# EAGLE design Mirtle_2020_drv8833 (EAGLE 7.6.0)
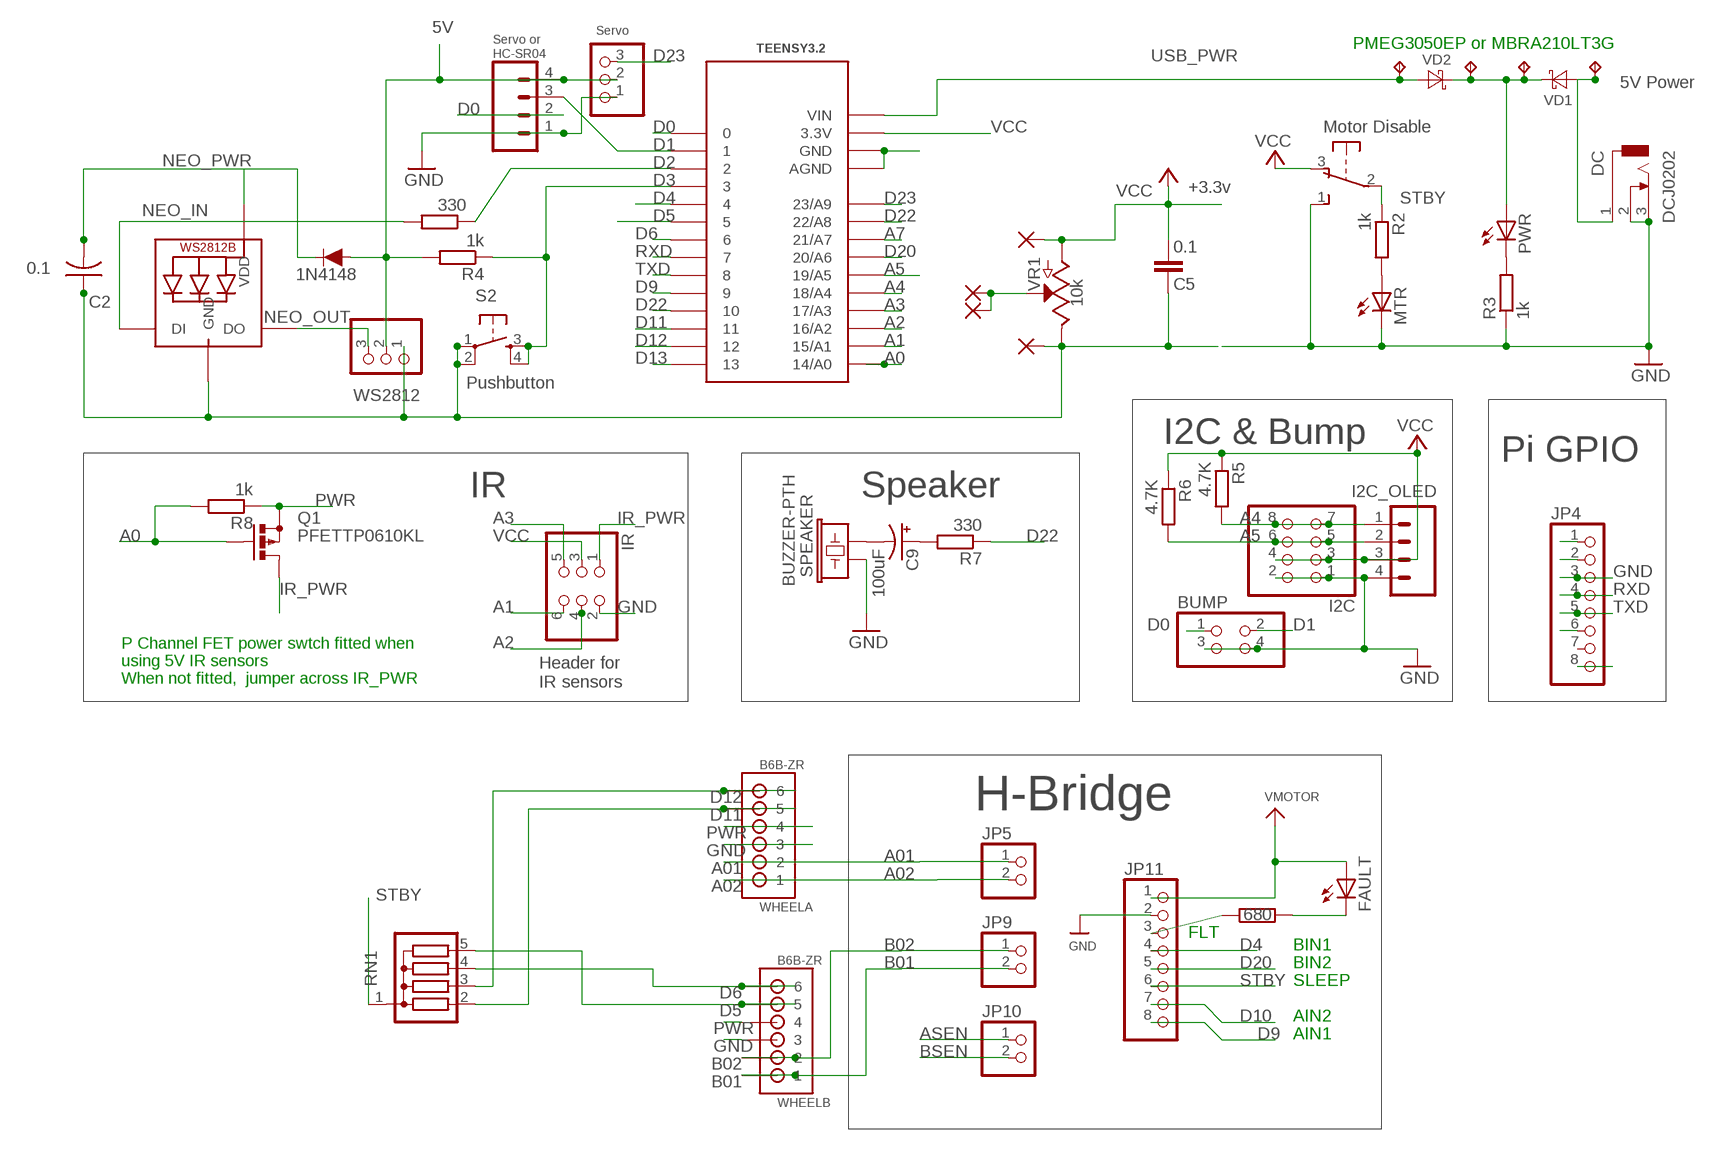
[diagram p0: schematic, sheet 1]

## Parts
BUMP  PINHD-2X2  [2X02]
C2  0.1  C-US025-024X044  [C025-024X044]
C5  0.1  CAPEZ  [CAP-PTH-SMALLEZ]
C9  100uF  CPOL-USE2.5-5  [E2,5-5]
DC  DCJ0202  [DCJ0202]
EXT  PINHD-1X3  [1X03]
FAULT  LED3MM  [LED3MM]
HC-SR04  CONN_04  [1X04]
I2C  PINHD-2X4  [2X04]
I2C_OLED  CONN_04  [1X04]
IN4148  200mA/100V/1V  DIODE-1N4148  [DIODE-1N4148]
IR  PINHD-2X3  [2X03]
JP4  PINHD-1X8BIG  [1X08-BIG]
JP5  HEADER-1X2ROUND  [1X02_ROUND]
JP9  HEADER-1X2ROUND  [1X02_ROUND]
JP10  HEADER-1X2ROUND  [1X02_ROUND]
JP11  HEADER-1X870MIL  [1X08_ROUND_70]
LED1  WS2812B5050  [WS2812B]
MTR  LED3MM  [LED3MM]
PAD6  1,6/0,8  [1,6/0,8]
PAD7  1,6/0,8  [1,6/0,8]
PAD8  1,6/0,8  [1,6/0,8]
PAD9  1,6/0,8  [1,6/0,8]
PWR  LED3MM  [LED3MM]
Q1  PFETTP0610KL  [TO92-OVAL]
R1  680  R-EU_0204/7  [0204/7]
R2  1k  R-EU_0204/5  [0204/5]
R3  1k  R-EU_0204/5  [0204/5]
R4  1k  R-EU_0204/5  [0204/5]
R5  4.7K  R-EU_0204/7  [0204/7]
R6  4.7K  R-EU_0204/7  [0204/7]
R7  330  R-EU_0204/7  [0204/7]
R8  1k  R-EU_0204/5  [0204/5]
R12  330  R-EU_0204/7  [0204/7]
RN1  G04R  [SIL5]
S2  TAC_SWITCHPTH  [TACTILE-PTH]
SPEAKER  BUZZER-PTH  [BUZZER-12MM]
SW1  OS102011MA1Q  [OS102011MA1Q]
TEENSY3.2  TEENSY_3.0_BASIC  [TEENSY_3.0_BASIC]
TP1  TPPAD1-13  [P1-13]
TP2  TPPAD1-13  [P1-13]
TP3  TPPAD1-13  [P1-13]
TP4  TPPAD1-13  [P1-13]
VD1  DIODE-SCHOTTKY-SMA  [SMA]
VD2  DIODE-SCHOTTKY-SMA  [SMA]
VR1  10k  POTENTIOMETER-PTH-9MM-1/20W-20%-KIT  [POT-PTH-ALPS-KIT]
WHEELA  B6B-ZR  [B6B-ZR]
WHEELB  B6B-ZR  [B6B-ZR]
WS2812  PINHD-1X3  [1X03]

## Nets
5VIN: DC.1 TP1.TP VD1.A
A0: Q1.2(G) R8.2 TEENSY3.2.14/A0
A1: IR.6 TEENSY3.2.15/A1
A01: JP5.1 WHEELA.2
A2: IR.4 TEENSY3.2.16/A2
A02: JP5.2 WHEELA.1
A3: IR.5 TEENSY3.2.17/A3
A4: I2C.7 I2C.8 I2C_OLED.1 R5.2 TEENSY3.2.18/A4
A5: I2C.5 I2C.6 I2C_OLED.2 R6.2 TEENSY3.2.19/A5
A7: PAD6.1(P) PAD9.1(P) TEENSY3.2.21/A7 VR1.P$2(S)
ASEN: JP10.1
B01: JP9.2 WHEELB.1
B02: JP9.1 WHEELB.2
BSEN: JP10.2
D0: BUMP.1 HC-SR04.2 TEENSY3.2.0
D1: BUMP.2 HC-SR04.3 TEENSY3.2.1
D2: R12.1 TEENSY3.2.2
D3: R4.1 S2.3 S2.4 TEENSY3.2.3
D4: JP11.4 TEENSY3.2.4
D5: RN1.5 TEENSY3.2.5 WHEELB.5
D6: RN1.4 TEENSY3.2.6 WHEELB.6
D9: JP11.8 TEENSY3.2.9
D10: JP11.7 TEENSY3.2.10
D11: RN1.2 TEENSY3.2.11 WHEELA.5
D12: RN1.3 TEENSY3.2.12 WHEELA.6
D13: TEENSY3.2.13
D20: JP11.5 TEENSY3.2.20/A6
D22: R7.1 TEENSY3.2.22/A8
D23: EXT.3 TEENSY3.2.23/A9
GND: BUMP.3 BUMP.4 C2.1 C5.1 DC.2 DC.3 EXT.1 HC-SR04.1 I2C.1 I2C.2 I2C_OLED.4 IR.2 JP4.3 JP4.8 JP11.2 LED1.3-GND(GND) MTR.K(C) PAD8.1(P) R3.1 S2.1 S2.2 SPEAKER.+ SW1.1(S) TEENSY3.2.AGND TEENSY3.2.GND VR1.P$1(E) WHEELA.3 WHEELB.3 WS2812.1
IR_PWR: IR.1 Q1.3(D)
N$1: JP11.3 R1.1
N$2: FAULT.K(C) R1.2
N$3: PWR.K(C) R3.2
N$8: MTR.A R2.2
N$10: JP4.6
N$15: C9.- SPEAKER.-
N$16: C9.+ R7.2
NEO_IN: LED1.4-DIN(DI) R12.2
NEO_OUT: LED1.2-DOUT(DO) WS2812.3
NEO_PWR: C2.2 IN4148.C LED1.1-VDD(VDD)
PWR: EXT.2 FAULT.A HC-SR04.4 IN4148.A JP4.1 JP4.2 JP11.1 PWR.A Q1.1(S) R4.2 R8.1 TP2.TP TP3.TP VD1.C VD2.C WHEELA.4 WHEELB.4 WS2812.2 ; supply symbol labelled VMOTOR
RXD: JP4.4 TEENSY3.2.7
STBY: JP11.6 R2.1 RN1.1 SW1.2(P)
TXD: JP4.5 TEENSY3.2.8
USB_PWR: TEENSY3.2.VIN TP4.TP VD2.A
VCC: C5.2 I2C.3 I2C.4 I2C_OLED.3 IR.3 PAD7.1(P) R5.1 R6.1 SW1.3(O) TEENSY3.2.3.3V VR1.P$3(A)
Unconnected: JP4.7 SW1.MT1(MT) SW1.MT2(MT)

## Notes on the sheet
- 5V | Servo | PMEG3050EP or MBRA210LT3G
- Servo or
- 5V Power
- Motor Disable
- +3.3v
- 1N4148
- Pushbutton
- I2C & Bump
- Pi GPIO
- IR | Speaker
- P Channel FET power swtch fitted when 
  using 5V IR sensors
  When not fitted,  jumper across IR_PWR
- Header for
  IR sensors
- H-Bridge
- FLT
- BIN1
- BIN2
- SLEEP
- AIN2
- AIN1

## Library data of the parts
BUMP = pinhead:PINHD-2X2: PIN HEADER
C2 = adafruit_mem:C-US: CAPACITOR, American symbol
C5 = SparkFun-Passives:CAP: Capacitor Standard 0603 ceramic capacitor, and 0.1" leaded capacitor.
C9 = adafruit:CPOL-US: POLARIZED CAPACITOR, American symbol
DC = con-jack:DCJ0202: DC POWER JACK Source: DCJ0202.pdf; OC_FARNELL: unknown; OC_NEWARK: unknown
EXT WS2812 = adafruit:PINHD-1X3: PIN HEADER
FAULT MTR PWR = led:LED: LED OSRAM: - CHIPLED LG R971, LG N971, LY N971, LG Q971, LY Q971, LO R971, LY R971 LH N974, LH R974 LS Q976, LO Q976, LY Q976 LO Q996 - Hyper CHIPLED LW Q18S LB Q993, LB Q99A, LB R99A - SideLED LS A670, LO A670, LY A670, LG A670, LP A670 LB A673, LV A673, LT A673, LW A673 LH A674 LY A675 LS A676, LA A676, LO A676, LY A676, LW A676 LS A679, LY A679, LG A679 - Hyper Micro SIDELED® LS Y876, LA Y876, LO Y876, LY Y876 LT Y87S - SmartLED LW L88C, LW L88S LB L89C, LB L89S, LG L890 LS L89K, LO L89K, LY L89K LS L896, LA L896, LO L896, LY L896 - TOPLED LS T670, LO T670, LY T670, LG T670, LP T670 LSG T670, LSP T670, LSY T670, LOP T670, LYG T670 LG T671, LOG T671, LSG T671 LB T673, LV T673, LT T673, LW T673 LH T674 LS T676, LA T676, LO T676, LY T676, LB T676, LH T676, LSB T676, LW T676 LB T67C, LV T67C, LT T67C, LS T67K, LO T67K, LY T67K, LW E67C LS E67B, LA E67B, LO E67B, LY E67B, LB E67C, LV E67C, LT E67C LW T67C LS T679, LY T679, LG T679 LS T770, LO T770, LY T770, LG T770, LP T770 LB T773, LV T773, LT T773, LW T773 LH T774 LS E675, LA E675, LY E675, LS T675 LS T776, LA T776, LO T776, LY T776, LB T776 LHGB T686 LT T68C, LB T68C - Hyper Mini TOPLED® LB M676 - Mini TOPLED Santana® LG M470 LS M47K, LO M47K, LY M47K Source: http://www.osram.convergy.de LUXEON: - LUMILED® LXK2-PW12-R00, LXK2-PW12-S00, LXK2-PW14-U00, LXK2-PW14-V00 LXK2-PM12-R00, LXK2-PM12-S00, LXK2-PM14-U00 LXK2-PE12-Q00, LXK2-PE12-R00, LXK2-PE12-S00, LXK2-PE14-T00, LXK2-PE14-U00 LXK2-PB12-K00, LXK2-PB12-L00, LXK2-PB12-M00, LXK2-PB14-N00, LXK2-PB14-P00, LXK2-PB14-Q00 LXK2-PR12-L00, LXK2-PR12-M00, LXK2-PR14-Q00, LXK2-PR14-R00 LXK2-PD12-Q00, LXK2-PD12-R00, LXK2-PD12-S00 LXK2-PH12-R00, LXK2-PH12-S00 LXK2-PL12-P00, LXK2-PL12-Q00, LXK2-PL12-R00 Source: www.luxeon.com KINGBRIGHT: KA-3528ASYC Source: www.kingbright.com
HC-SR04 I2C_OLED = SparkFun-Connectors:CONN_04: Multi connection point. Often used as Generic Header-pin footprint for 0.1 inch spaced/style header connections On any of the 0.1 inch spaced packages, you can populate with these: Break Away Headers - Straight <https://www.sparkfun.com/products/116> (PRT-00116) Break Away Male Headers - Right Angle <https://www.sparkfun.com/products/553> (PRT-00553) Female Headers <https://www.sparkfun.com/products/115> (PRT-00115) Break Away Headers - Machine Pin <https://www.sparkfun.com/products/117> (PRT-00117) Break Away Female Headers - Swiss Machine Pin <https://www.sparkfun.com/products/743> (PRT-00743) For SCREWTERMINALS and SPRING TERMINALS visit here: Screw Terimnals on SparkFun.com <https://www.sparkfun.com/search/results?term=Screw+Terminals> (5mm/3.5mm/2.54mm spacing) This device is also useful as a general connection point to wire up your design to another part of your project. Our various solder wires solder well into these plated through hole pads. Hook-Up Wire - Assortment (Stranded, 22 AWG) <https://www.sparkfun.com/products/11375> (PRT-11375) Hook-Up Wire - Assortment (Solid Core, 22 AWG) <https://www.sparkfun.com/products/11367> (PRT-11367) View the entire wire category on our website here <https://www.sparkfun.com/categories/141> Special notes: Molex polarized connector foot print use with SKU : PRT-08231 with associated crimp pins and housings. 1MM SMD Version SKU: PRT-10208; PROD_ID: CONN-09696
I2C = adafruit:PINHD-2X4: PIN HEADER
IN4148 = SparkFun-DiscreteSemi:DIODE: Diode These are standard reverse protection diodes and small signal diodes. SparkFun Products: SparkFun SparkPunk Sound Kit <https://www.sparkfun.com/products/11177> SparkFun ESP8266 Thing <https://www.sparkfun.com/products/13231>; PROD_ID: DIO-08378
IR = pinhead:PINHD-2X3: PIN HEADER
JP4 = adafruit:PINHD-1X8: PIN HEADER
JP5 JP9 JP10 = microbuilder:HEADER-1X2: PIN HEADER
JP11 = microbuilder:HEADER-1X8: PIN HEADER
LED1 = adafruitx:WS2812B
PAD6-PAD9 = wirepad:1,6/0,8: THROUGH-HOLE PAD
Q1 = adafruit:PFET: P-CHANNEL MOS FET
R1-R8 R12 = resistor:R-EU_: RESISTOR, European symbol
RN1 = resistor-sil:G04R: SIL RESISTOR; OC_FARNELL: unknown; OC_NEWARK: unknown
S2 = SparkFun-Electromechanical:TAC_SWITCH: Momentary Switch Button commonly used for reset or general input. Spark Fun Electronics SKU : COM-00097 SMT- SWCH-08247
SPEAKER = SparkFun-Electromechanical:BUZZER: Buzzer Small round buzzers that operate around the audible 2kHz range. You can use these as speakers to create simple music or user interfaces. Variant Overview: PTH - Mini Speaker - PC Mount 12mm 2.048kHz <https://www.sparkfun.com/products/7950> PTH_KIT - Mini Speaker - PC Mount 12mm 2.048kHz <https://www.sparkfun.com/products/7950> KIT simplifies soldering by adding stop mask to one side of the pads. PTH_NO_SILK - Mini Speaker - PC Mount 12mm 2.048kHz <https://www.sparkfun.com/products/7950> No silkscreen indicator of buzzer outline. PTH_KIT_NO_SILK - Mini Speaker - PC Mount 12mm 2.048kHz <https://www.sparkfun.com/products/7950> KIT package w/o silkscreen SMD - Buzzer Audio Magnetic (CCV-084B16) SMD buzzer used on, e.g. the LilyPad Buzzer <https://www.sparkfun.com/products/8463> and RFID USB Reader <https://www.sparkfun.com/products/9963>. SMD_KIT - Buzzer Audio Magnetic (CCV-084B16) SMD Buzzer with elongated pins to make soldering easier. Used on the SparkFun Simon Says - Surface Mount Soldering Kit <https://www.sparkfun.com/products/10935>.; PROD_ID: COMP-08253; SF_SKU: COM-07950
SW1 = adafruit_mem:OS102011MA1Q: OS10201MA1Q through-hole right angle switch http://www.ladyada.net/library/eagle
TEENSY3.2 = Teensy3.0_mem:TEENSY_3.0_BASIC: Basic Teensy 3.0 with none of the 'inner' pins enabled. See '+4', 'AllAnalogPins", and 'AllPins' packages for additional pin holes, as needed.
TP1-TP4 = testpad:TP: Test pad
VD1 VD2 = diod_barthess:DIODE-SCHOTTKY-: SCHOTTKY DIODE
VR1 = SparkFun-Resistors:POTENTIOMETER: Potentiometer (Pot) Three-terminal potentiometers, with an adjustable wiper and two adjustable resistors. A pot can be used to create a configurable voltage divider, or as a variable resistor. Variants ALPS_POT and ALPS_POT_KIT - PTH, breadboard compatible, 9mm square pots Rotary Potentiometer - Linear (10k ohm) <https://www.sparkfun.com/products/9288> (COM-09288) The KIT variant exposes copper on only one side of the PTH pad, so the part can only be assembled on one side of the PCB. Useful for beginner soldering kits.; PROD_ID: RES-09177; SF_SKU: COM-09288
WHEELA WHEELB = jst:B6B-ZR: JST-ZH Connector 6 pol, 1.5mm pitch Package: B6B-ZR Source: http://www.jst-mfg.com/product/pdf/eng/eZH.pdf

## Net classes
1 power: width 0.305 mm, clearance 0.305 mm

## Board
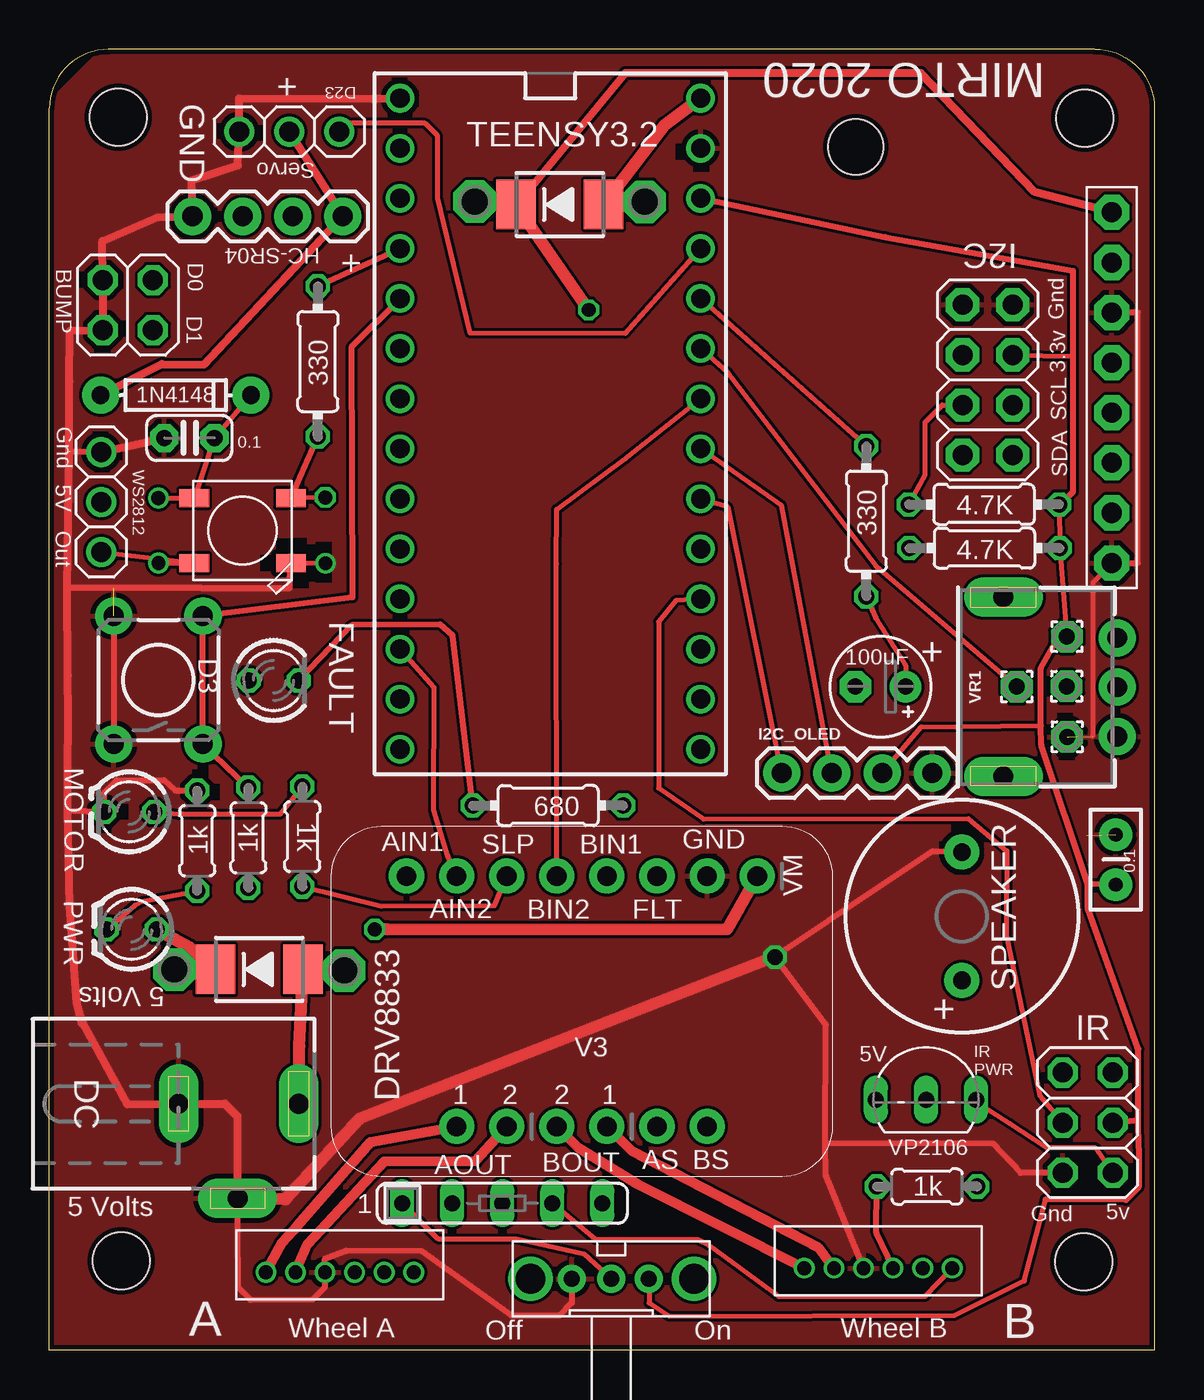
[diagram p1: board, top side]
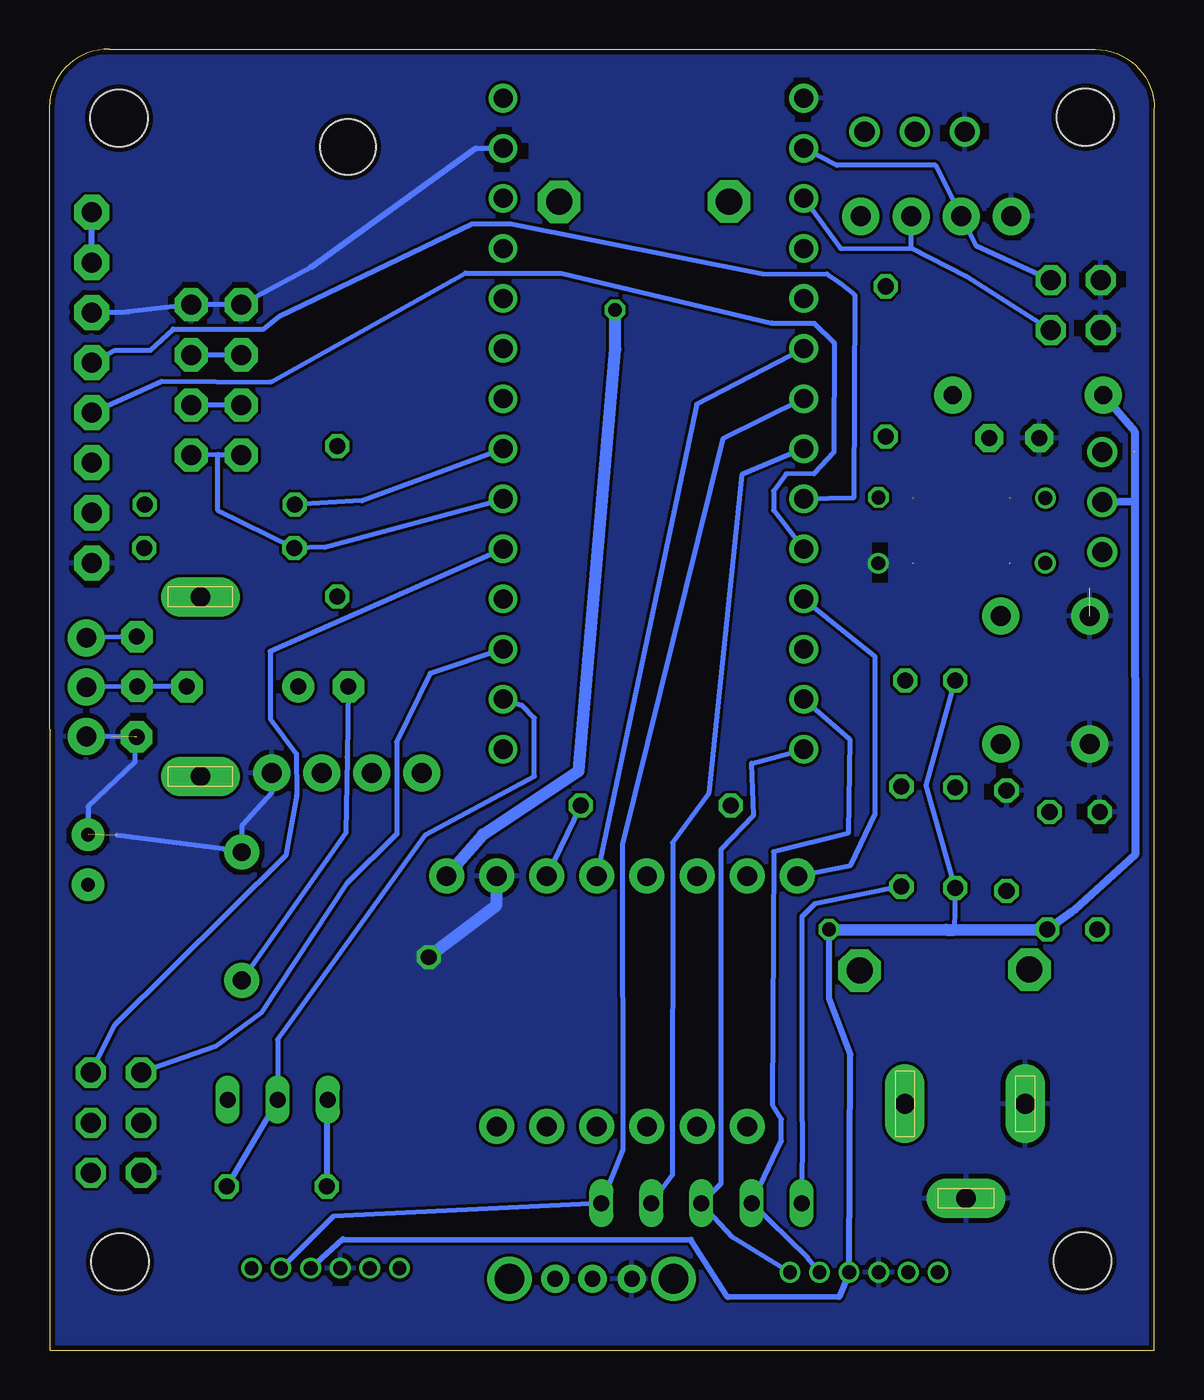
[diagram p2: board, bottom side, seen from below]

Size 56.03 x 65.98 mm. Coordinates in mm from the lower left corner, seen from the top.
Outline: 53,65.98 3,65.98 arc90 0,62.98 0,0 56.01,0 56.03,63.04 arc90 53,65.98
Copper layers (1*2*15*16): Top 0.035mm / dielectric 0.2mm / Route2 0.0175mm / dielectric 1.1mm / Route15 0.0175mm / dielectric 0.2mm / Bottom 0.035mm
Design rules "SeeedStudio_DRU_no_angle": minimum track width 6mil, minimum drill 12mil, track to track 6mil, track to pad 6mil, pad to pad 6mil, via to via 6mil, smd to smd 0mil, copper to edge 10mil, drill to drill 10mil, minimum pad ring 6mil, minimum via ring 6mil, stop-mask expansion 2mil, vias tented up to drill 25mil, thermal gap 10mil
Holes 2.9 mm at 52.5,62.48 3.65,4.53 3.5,62.53 52.45,4.48
Holes 2.8 mm at 40.89,61.03
tRestrict: area 40.9,3.2 to 41.7,4; area 51,7.9 to 51.8,8.7; area 51.6,8.6 to 52.5,9.4; area 46.6,24.9 to 47.4,25.7; area 45.7,25.7 to 46.5,26.5; area 53.8,30.1 to 54.6,30.9; area 54.4,30.6 to 55.2,31.4; area 53.6,31.4 to 54.4,32.2; area 51.1,31.5 to 51.9,32.3; area 54.1,52.2 to 54.9,53; area 53.4,51.6 to 54.2,52.4; area 48.4,51.9 to 49.2,52.7; 40 more areas
bRestrict: area 53.5,52.9 to 54.3,53.7; area 3.3,51.4 to 4.1,52.2; area 2.3,50.6 to 3.1,51.4; area 3,53.8 to 3.8,54.6; area 1.5,53.9 to 2.2,54.7; area 2.2,45.8 to 3,46.6; area 2.2,44.5 to 3,45.3; area 1.6,45.2 to 2.4,46; area 40.9,3.3 to 41.6,4.1; area 51,7.9 to 51.8,8.7; area 50.9,9.3 to 51.7,10.1; area 51.6,8.6 to 52.5,9.4; 40 more areas

### Footprints (pad centres in the part's own frame; a part is rotated, then mirrored left to right if it is on the bottom)
2X02 = drill 1.016 octagon: 1 -1.27,-1.27; 2 -1.27,1.27; 3 1.27,-1.27; 4 1.27,1.27
C025-024X044 = drill 0.813 pad 1.422 octagon: 1 -1.27,0; 2 1.27,0
CAP-PTH-SMALLEZ = drill 0.7 pad 1.651: 1 0,0; 2 2.54,0
E2,5-5 = drill 0.813 pad 1.6: + -1.27,0 | drill 0.813 pad 1.6 octagon: - 1.27,0
DCJ0202 = drill 1 pad 2 long: 1 0,3.1; 2 4.8,0; 3 0,-3
1X03 = drill 1.016: 1 -2.54,0; 2 0,0; 3 2.54,0
LED3MM = drill 0.813 octagon: A -1.27,0; K 1.27,0
1X04 = drill 1.016 pad 1.88: 1 0,0; 2 2.54,0; 3 5.08,0; 4 7.62,0
2X04 = drill 1.016 pad 1.676 octagon: 1 -3.81,-1.27; 2 -3.81,1.27; 3 -1.27,-1.27; 4 -1.27,1.27; 5 1.27,-1.27; 6 1.27,1.27; 7 3.81,-1.27; 8 3.81,1.27
DIODE-1N4148 = drill 0.9 pad 1.88: A -3.81,0; C 3.81,0
2X03 = drill 1.016 octagon: 1 -2.54,-1.27; 2 -2.54,1.27; 3 0,-1.27; 4 0,1.27; 5 2.54,-1.27; 6 2.54,1.27
1X08-BIG = drill 1.016 pad 1.778 octagon: 1 -8.89,0; 2 -6.35,0; 3 -3.81,0; 4 -1.27,0; 5 1.27,0; 6 3.81,0; 7 6.35,0; 8 8.89,0
1X02_ROUND = drill 1 pad 1.778: 1 -1.27,0; 2 1.27,0
1X08_ROUND_70 = drill 1 pad 1.778: 1 -8.89,0; 2 -6.35,0; 3 -3.81,0; 4 -1.27,0; 5 1.27,0; 6 3.81,0; 7 6.35,0; 8 8.89,0
WS2812B = smd 1.5 x 0.9: 1-VDD 2.45,-1.65; 2-DOUT 2.45,1.65; 3-GND -2.45,1.65; 4-DIN -2.45,-1.65
1,6/0,8 = drill 0.813 pad 1.6 octagon: 1 0,0
TO92-OVAL = drill 0.813 long: 1 -2.54,0; 2 0,0; 3 2.54,0
0204/7 = drill 0.813 octagon: 1 -3.81,0; 2 3.81,0
0204/5 = drill 0.813 octagon: 1 -2.54,0; 2 2.54,0
SIL5 = drill 0.813 long: 1 -5.08,0; 2 -2.54,0; 3 0,0; 4 2.54,0; 5 5.08,0
TACTILE-PTH = drill 1.016 pad 1.88: 1 -3.251,2.261; 2 3.251,2.261; 3 -3.251,-2.261; 4 3.251,-2.261
BUZZER-12MM = drill 0.9 pad 1.778: + 3.25,0; - -3.25,0
OS102011MA1Q = drill 0.8 pad 1.422: 1 -2,0; 2 0,0; 3 1.9,0 | drill 1.5 pad 2.184: MT1 -4.1,0; MT2 4.2,0
TEENSY_3.0_BASIC = drill 0.965: 0 -7.62,13.97; 1 -7.62,11.43; 2 -7.62,8.89; 3 -7.62,6.35; 3.3V 7.62,11.43; 4 -7.62,3.81; 5 -7.62,1.27; 6 -7.62,-1.27; 7 -7.62,-3.81; 8 -7.62,-6.35; 9 -7.62,-8.89; 10 -7.62,-11.43; 11 -7.62,-13.97; 12 -7.62,-16.51; 13 7.62,-16.51; 14/A0 7.62,-13.97; 15/A1 7.62,-11.43; 16/A2 7.62,-8.89; 17/A3 7.62,-6.35; 18/A4 7.62,-3.81; 19/A5 7.62,-1.27; 20/A6 7.62,1.27; 21/A7 7.62,3.81; 22/A8 7.62,6.35; 23/A9 7.62,8.89; AGND 7.62,13.97; GND -7.62,16.51; VIN 7.62,16.51
P1-13 = drill 1.321 pad 2.159 octagon: TP 0,0
SMA = smd 2 x 2.5: A 2.223,0; C -2.223,0
POT-PTH-ALPS-KIT = drill 1 pad 2 long: 1 1.22,4.57; 2 1.22,-4.52 | drill 1 pad 1.88: P$1 7,-2.5; P$2 7,0; P$3 7,2.5
B6B-ZR = drill 0.7: 1 9,-1.3; 2 7.5,-1.3; 3 6,-1.3; 4 4.5,-1.3; 5 3,-1.3; 6 1.5,-1.3

### Placement (x,y rotation side)
BUMP  3.98,53.01 180 top
C2  7.11,46.27 0 top
C5  54.07,26.15 270 top
C9  42.14,33.65 180 top
DC  9.55,12.5 270 top
EXT  12.16,61.8 0 top
FAULT  11.38,33.98 0 top
HC-SR04  7.26,57.51 0 top
I2C  47.57,49.21 270 top
I2C_OLED  37.14,29.27 0 top
IN4148  6.41,48.44 0 top
IR  52.65,11.54 90 top
JP4  53.87,48.82 270 top
JP5  21.92,11.35 180 top
JP9  27,11.35 180 top
JP10  32.08,11.35 0 top
JP11  27,24.05 180 top
LED1  9.8,41.57 180 top
MTR  4.05,27.3 180 top
PAD6  49.05,33.65 0 top
PAD7  51.59,36.19 0 top
PAD8  51.6,31.11 0 top
PAD9  51.58,33.67 0 top
PWR  4.17,21.34 180 top
Q1  44.45,12.7 0 top
R1  25.28,27.62 180 top
R2  12.82,26.05 90 top
R3  7.5,25.84 270 top
R4  10.09,25.99 270 top
R5  47.41,40.68 180 top
R6  47.39,42.9 180 top
R7  41.42,42.05 270 top
R8  44.5,8.3 0 top
R12  13.62,50.15 270 top
RN1  22.96,7.46 0 top
S2  5.53,33.99 90 top
SPEAKER  46.27,22.01 90 top
SW1  28.49,3.62 0 top
TEENSY3.2  25.4,46.99 0 top
TP1  14.95,19.26 0 top
TP2  6.34,19.3 0 top
TP3  21.57,58.26 0 top
TP4  30.18,58.24 0 top
VD1  10.64,19.32 0 top
VD2  25.88,58.11 0 top
VR1  47.15,33.63 0 top
WHEELA  19.98,2.65 180 top
WHEELB  47.28,2.86 180 top
WS2812  2.64,43.02 270 top

### Tracks (layer width: path | path; a pad name or v marks a point on that pad's centre or on a via)
5VIN
  Top 0.305: TP1.TP VD1.A
  Top 0.61: DC.1 12.68,15.43 VD1.A
A0
  Bottom 0.254: TEENSY3.2.14/A0 32.06,32.7 31.44,32.07 31.44,29.1 36.97,26.13 44.45,15.76 Q1.2
  Bottom 0.305: Q1.2 R8.2
A1
  Bottom 0.254: IR.6 47.58,15.42 45.28,17.12 40.94,23.68 38.41,26.18 38.42,30.84 36.72,34.33 TEENSY3.2.15/A1
A01
  Top 0.508: WHEELA.2 13.11,5.4 16.98,9.57 21.6,9.6 JP5.1
A2
  Top 0.254: IR.4 50.22,12.89 48.52,21.03 48.55,25.33 46.6,26.96 33.17,26.94 30.89,28.51 30.89,36.95 31.75,38.01 TEENSY3.2.16/A2
A02
  Top 0.508: WHEELA.1 11.82,5.48 12.57,6.3 16.29,10.56 JP5.2
A3
  Bottom 0.254: TEENSY3.2.17/A3 44.84,35.45 44.82,32.01 43.5,30.25 43.49,28.15 44.03,25.1 52.7,16.51 IR.5
A4
  Top 0.254: I2C_OLED.1 34.42,42.75 TEENSY3.2.18/A4
  Bottom 0.254: 46.37,45.42 47.48,45.43 47.49,42.59 R5.2 42.08,40.73 TEENSY3.2.18/A4 | 46.37,45.42 I2C.8 | I2C.7 46.37,45.42
A5
  Top 0.254: R6.2 44.4,44.41 44.4,47.07 45.27,47.94 I2C.5 | I2C_OLED.2 37.13,42.85 TEENSY3.2.19/A5
  Bottom 0.254: I2C.5 I2C.6 | R6.2 40.19,43.09 TEENSY3.2.19/A5
A7
  Top 0.254: PAD6.1 41.92,39.77 34.4,49.59 TEENSY3.2.21/A7
  Bottom 0.254: PAD6.1 PAD9.1 VR1.P$2
B01
  Top 0.508: WHEELB.1 29.86,8.39 26.84,10.24 JP9.2
B02
  Top 0.508: WHEELB.2 39.01,5.19 29.55,10.09 JP9.1
D0
  Bottom 0.254: BUMP.1 9.03,56 HC-SR04.2 11.1,60.1 16.1,60.09 TEENSY3.2.0
D1
  Bottom 0.254: BUMP.2 9.52,54.45 12.33,55.89 | 12.33,55.89 HC-SR04.3 | TEENSY3.2.1 15.91,55.88 12.33,55.89
D2
  Top 0.305: R12.1 TEENSY3.2.2
D3
  Top 0.305: TEENSY3.2.3 15.32,50.87 15.37,38.17 S2.4 S2.3 R4.1
D4
  Bottom 0.254: TEENSY3.2.4 23.21,47.98 JP11.4
D5
  Bottom 0.254: TEENSY3.2.5 21.89,46.23 26.98,25.64 26.96,10.16 RN1.5 41.65,6.79 WHEELB.5
D6
  Top 0.254: WHEELB.6 44.41,2.73 36.98,2.73 33.45,5.32 32.87,5.61 27.68,5.62 RN1.4
  Bottom 0.254: TEENSY3.2.6 20.91,44.41 22.61,28.23 24.43,25.75 24.44,8.89 RN1.4
D9
  Bottom 0.254: JP11.8 15.4,24.59 14.15,27.18 14.15,35.17 TEENSY3.2.9
D10
  Top 0.254: JP11.7 20.21,25.08 19.49,27.41 19.51,33.62 TEENSY3.2.10
D11
  Bottom 0.254: WHEELA.5 17.59,4.72 RN1.2 18.91,10.61 18.91,11.71 19.37,12.45 19.31,25.28 15.53,26.22 15.46,31 TEENSY3.2.11
D12
  Bottom 0.254: WHEELA.6 21.37,5.72 RN1.3 21.97,8.46 21.97,25.39 20.32,27.13 20.42,29.77 TEENSY3.2.12
D20
  Top 0.254: JP11.5 25.71,39.88 25.72,42.64 29.21,45.22 TEENSY3.2.20/A6
D22
  Top 0.254: R7.1 TEENSY3.2.22/A8
D23
  Top 0.254: TEENSY3.2.23/A9 29.2,51.56 21.33,51.59 19.68,58.42 19.68,61.59 19.05,62.23 15.24,62.23 EXT.3
GND  (via drill 0.7, 0.8)  (6 unrouted)
  Top 0.254: 52.89,31.13 52.91,38.94 JP4.8 | v14,39.91 12.22,39.92
  Top 0.305: 46.16,25.24 SPEAKER.+ 46.16,25.24 44.77,25.3 v36.79,19.94 39.37,16.51 39.35,10.46 | SW1.1 26.5,2.39 25.86,1.75 23.43,1.75 18.89,5.01 15.07,5.04 13.95,4.6 WHEELA.3 13.98,3.21 13.36,2.58 10.2,2.55 9.56,3.18 9.55,4.73 DC.2 | 0.94,27.36 MTR.K 2.77,28.26 3.41,28.9 5.81,28.91 6.38,28.4 R3.1 | 0.96,32.9 0.95,34.24 | JP4.8 55.19,39.93 55.19,52.63 JP4.3 | 0.92,38.65 3.27,38.65 7.74,38.65 12.19,38.65 12.22,39.92 | S2.2 S2.1 | WS2812.1 1.06,45.57 | WHEELB.3 39.37,8.89 39.35,10.46 | IR.2 49.24,8.99 47.82,10.48 39.35,10.46
  Top 0.406: 1.64,16.58 1.64,16.67 | 1.64,16.67 1.4,17.65 1.04,22.51 0.94,27.36 0.93,29.16 | 1.64,16.67 3.94,12.48 DC.3 8.9,12.5 9.54,11.87 9.54,9.14 DC.2 | 0.93,28.41 0.93,29.16 | 0.93,29.16 0.95,32.26 0.95,34.24 0.92,38.65 1,45.57 1.02,49.13 1.04,51.71 BUMP.4 BUMP.3 2.69,56.25 5.48,57.46 HC-SR04.1 7.22,59.34 9.56,60.09 EXT.1 9.62,63.49 16.73,63.48 TEENSY3.2.GND | WS2812.1 C2.1
  Top 0.61: v36.79,19.94 15.72,11.73 11.97,7.65 DC.2
  Bottom 0.254: 51.98,52.67 I2C.2 I2C.1 42.76,54.94 | 51.98,52.67 52.33,52.63 JP4.3 | 52.3,52.64 51.98,52.67 | 52.59,26.12 47.21,25.42 SPEAKER.+ 46.27,26.61 44.76,28.29 I2C_OLED.4 | 34.4,60.96 TEENSY3.2.AGND | C5.1 54.06,27.57 51.69,29.81 51.69,31.11 VR1.P$1
  Bottom 0.305: 42.76,54.94 34.4,60.96
  Bottom 0.61: JP11.2 33.38,22.54 v36.79,19.94
  pour Top: 0,0 0,63.21 2.54,65.75 54.61,65.75 55.88,64.48 55.88,0
  pour Bottom: 0,0 0,63.21 1.94,65.75 54.61,65.75 55.88,64.48 55.88,0
IR_PWR
  Top 0.254: 46.95,12.63 48.71,11.49 50.55,10.28 53.02,10.28 IR.1
  Top 0.305: 46.95,12.63 46.93,12.61 Q1.3
N$1
  Bottom 0.254: R1.1 JP11.3
N$2
  Top 0.305: R1.2 20.45,36.26 19.81,36.81 15.34,36.77 FAULT.K
N$3
  Top 0.254: PWR.K 4.34,22.56 4.69,22.76 R3.2
N$8
  Top 0.254: R2.2 11.69,27.18 6.57,27.17 MTR.A
N$15
  Bottom 0.254: C9.- 40.93,30.07 41,26.24 SPEAKER.-
N$16
  Top 0.254: R7.2 41.9,37.13 43.41,34.72 C9.+
NEO_IN  (via drill 0.7)  (1 unrouted)
  Top 0.254: v13.99,43.25 12.22,43.22
  Top 0.305: LED1.4-DIN R12.2
NEO_OUT  (via drill 0.7)  (1 unrouted)
  Top 0.254: WS2812.3 LED1.2-DOUT | v5.54,39.92 7.32,39.92
NEO_PWR  (via drill 0.7)  (1 unrouted)
  Top 0.254: IN4148.C C2.2 LED1.1-VDD | v5.53,43.22 7.32,43.22
PWR  (via drill 0.7)
  Top 0.305: TP3.TP 23.74,58.14 | TP2.TP VD1.C | WHEELB.4 41.93,5.96 R8.1
  Top 0.406: JP4.1 49.97,58.74 44.19,64.77 29.21,64.77 23.74,58.14 VD2.C 23.23,57.24 | IN4148.A 5.72,50.02 7.86,49.99 HC-SR04.4 EXT.2
  Top 0.61: v16.5,21.34 17.14,21.34 34.36,21.36 JP11.1 | PWR.A 7.12,20.43 VD1.C | v27.34,52.76 VD2.C
  Bottom 0.254: FAULT.A 11.58,28.64 R4.2 10.16,21.32
  Bottom 0.305: WHEELB.4 41.14,5.63 23.5,5.61 21.63,2.69 15.99,2.7 WHEELA.4 15.42,14.97 16.51,17.85 v16.5,21.34 | JP4.2 JP4.1 | Q1.1 41.96,12.7 R8.1
  Bottom 0.406: 0.98,25.15 4.03,22.35 4.2,22.23 PWR.A | 0.98,25.15 0.95,25.18 | IN4148.A 1,46.59 1,43.06 | 1,43.06 0.98,25.15 | WS2812.2 1,43.06
  Bottom 0.61: v16.5,21.34 10.56,21.32 10.16,21.32 PWR.A | JP11.1 34.04,26.16 29.19,29.37 27.33,50.76 v27.34,52.76
RXD
  Bottom 0.254: JP4.4 52.68,50.72 50.91,50.72 49.76,51.79 45.17,51.79 44.36,52.45 34.58,57.13 32.63,57.13 19.88,54.59 16.6,54.59 15.96,54.13 15.2,53.53 15.25,43.22 TEENSY3.2.7
STBY
  Top 0.254: SW1.2 27.13,4.85 23.69,5.63 19.73,5.63 RN1.1 | R2.1 16.84,22.53 22.58,22.55 JP11.6
  Bottom 0.254: RN1.1 17.86,11.57 17.86,16.29 17.86,22 17.23,22.64 R2.1
TXD
  Bottom 0.254: JP4.5 50.32,49.14 44.81,49.11 34.93,54.63 30.08,54.62 19.39,52.1 17.25,52.09 16.24,51.1 16.26,45.56 17.26,44.45 18.68,44.45 19.31,43.58 19.31,42.61 TEENSY3.2.8
USB_PWR
  Top 0.305: TP4.TP VD2.A
  Top 0.61: VD2.A 31.2,62.13 TEENSY3.2.VIN
VCC
  Top 0.254: R6.1 R5.1 PAD7.1 50.99,35.88 | I2C.4 51.88,50.43 | SW1.3 30.41,2.4 31.42,1.73 45.9,1.76 49.44,3.51 50.52,7.64 | I2C_OLED.3 44.22,31.61 50.27,31.67
  Top 0.305: 55.2,11.68 55.23,10.27 55.22,8.26 54.59,7.63 50.52,7.64 | 55.2,11.68 55.21,15.26 52.65,22.43 52.66,23.64 | 52.66,23.64 50.3,30.7 50.27,31.67 50.26,32.9 50.27,34.59 50.99,35.88 | C5.2 52.66,23.64 | R6.1 51.27,42.9 51.9,43.53 51.9,44.81 51.88,50.43 51.89,54.75 42.38,56.46 TEENSY3.2.3.3V | IR.3 55.2,11.68
  Bottom 0.254: I2C.3 I2C.4 | PAD7.1 VR1.P$3

### Text on the board
tPlace: MIRTO 2020 | AIN1 | SLP | BIN1 | GND | VM | AIN2 | BIN2 | FLT | V3 | 5V | IR / PWR | DRV8833 | 1 | 2 | 2 | 1 | VP2106 | AOUT | BOUT | AS | BS
tNames: + | D23 | GND | Servo | + | D0 | D1 | Gnd | 3.3v | 1N4148 | Gnd | SCL | 5V | SDA | Out | D3 | + | MOTOR | 5 Volts | + | 5 Volts | Gnd | 5v | A | Wheel A | Off | On | Wheel B | B